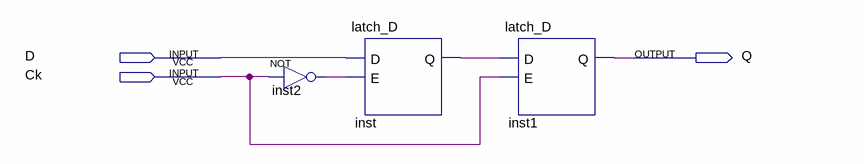
[diagram p0: schematic sheet]
// Quartus schematic flip_flop.bdf as structural Verilog: 3 symbols, 3 pins
module flip_flop (
  input  D,
  input  Ck,
  output Q
);

  wire inst2_out, inst_q;

  not inst2 (inst2_out, Ck);
  latch_D inst (.D(D), .E(inst2_out), .Q(inst_q));
  latch_D inst1 (.D(inst_q), .E(Ck), .Q(Q));
endmodule
